# Altium project vme_can_pcb_v4.PrjPcb (part 2 of 2)

## Sheet vme_can_fpga_bridge.SchDoc: =GlobalProjectName
size 594 x 420 mm; SheetNumber: 6; SheetTotal: 8; PageSetup: Record=PageOptions|CenterHorizontal=True|CenterVertical=True|PrintScale=1.00|XCorrection=1.00|YCorrection=1.00|PrintKind=1|BorderSize=5000000|LeftOffset=0|BottomOffset=0|Orientation=2|PaperLength=1000|PaperWidth=1000|Scale=100|PaperSource=15|PrintQuality=1200|MediaType=1|DitherType=10|PaperKind=A3|PrintScaleMode=1; Weight: -; ScaleFactor: -
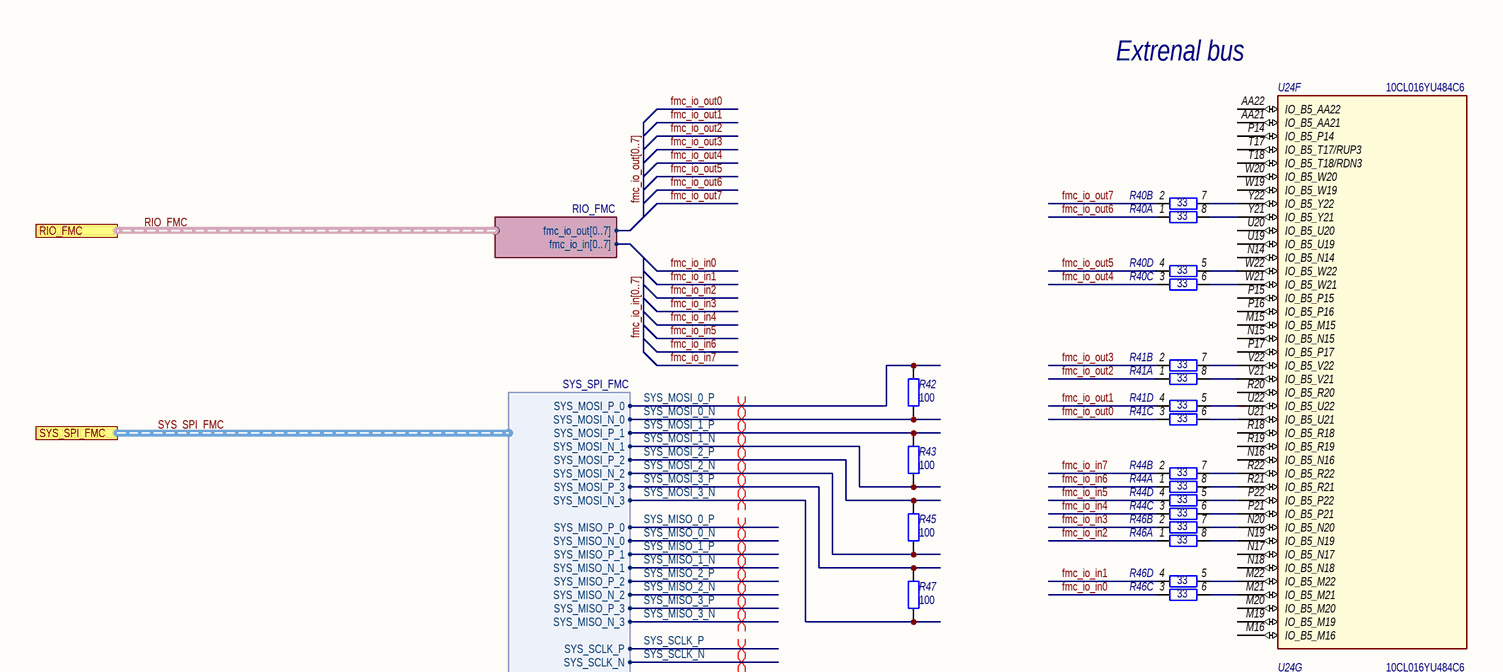
[diagram p5: vme_can_fpga_bridge.SchDoc, top left]
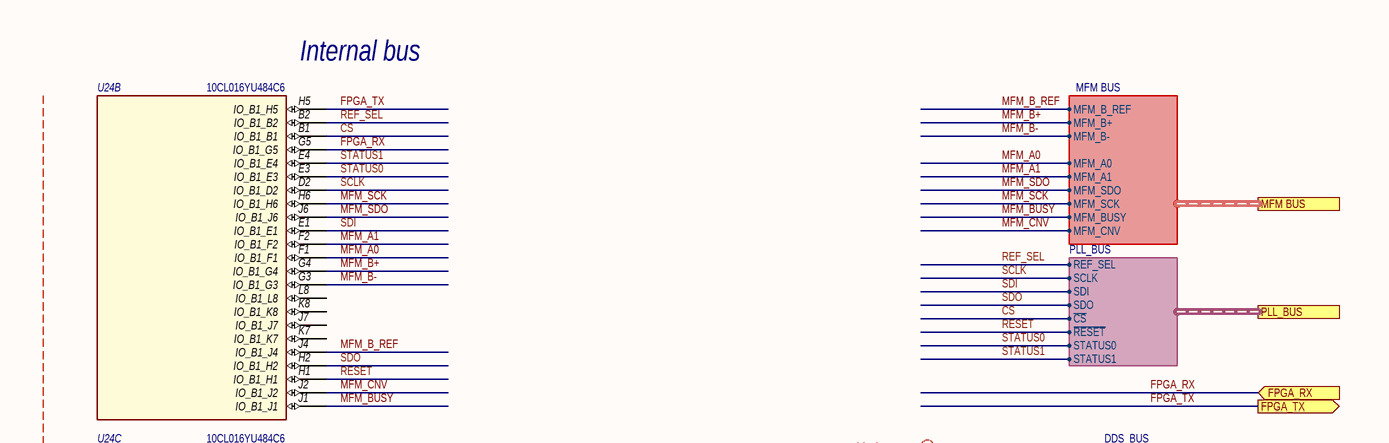
[diagram p6: vme_can_fpga_bridge.SchDoc, top right]
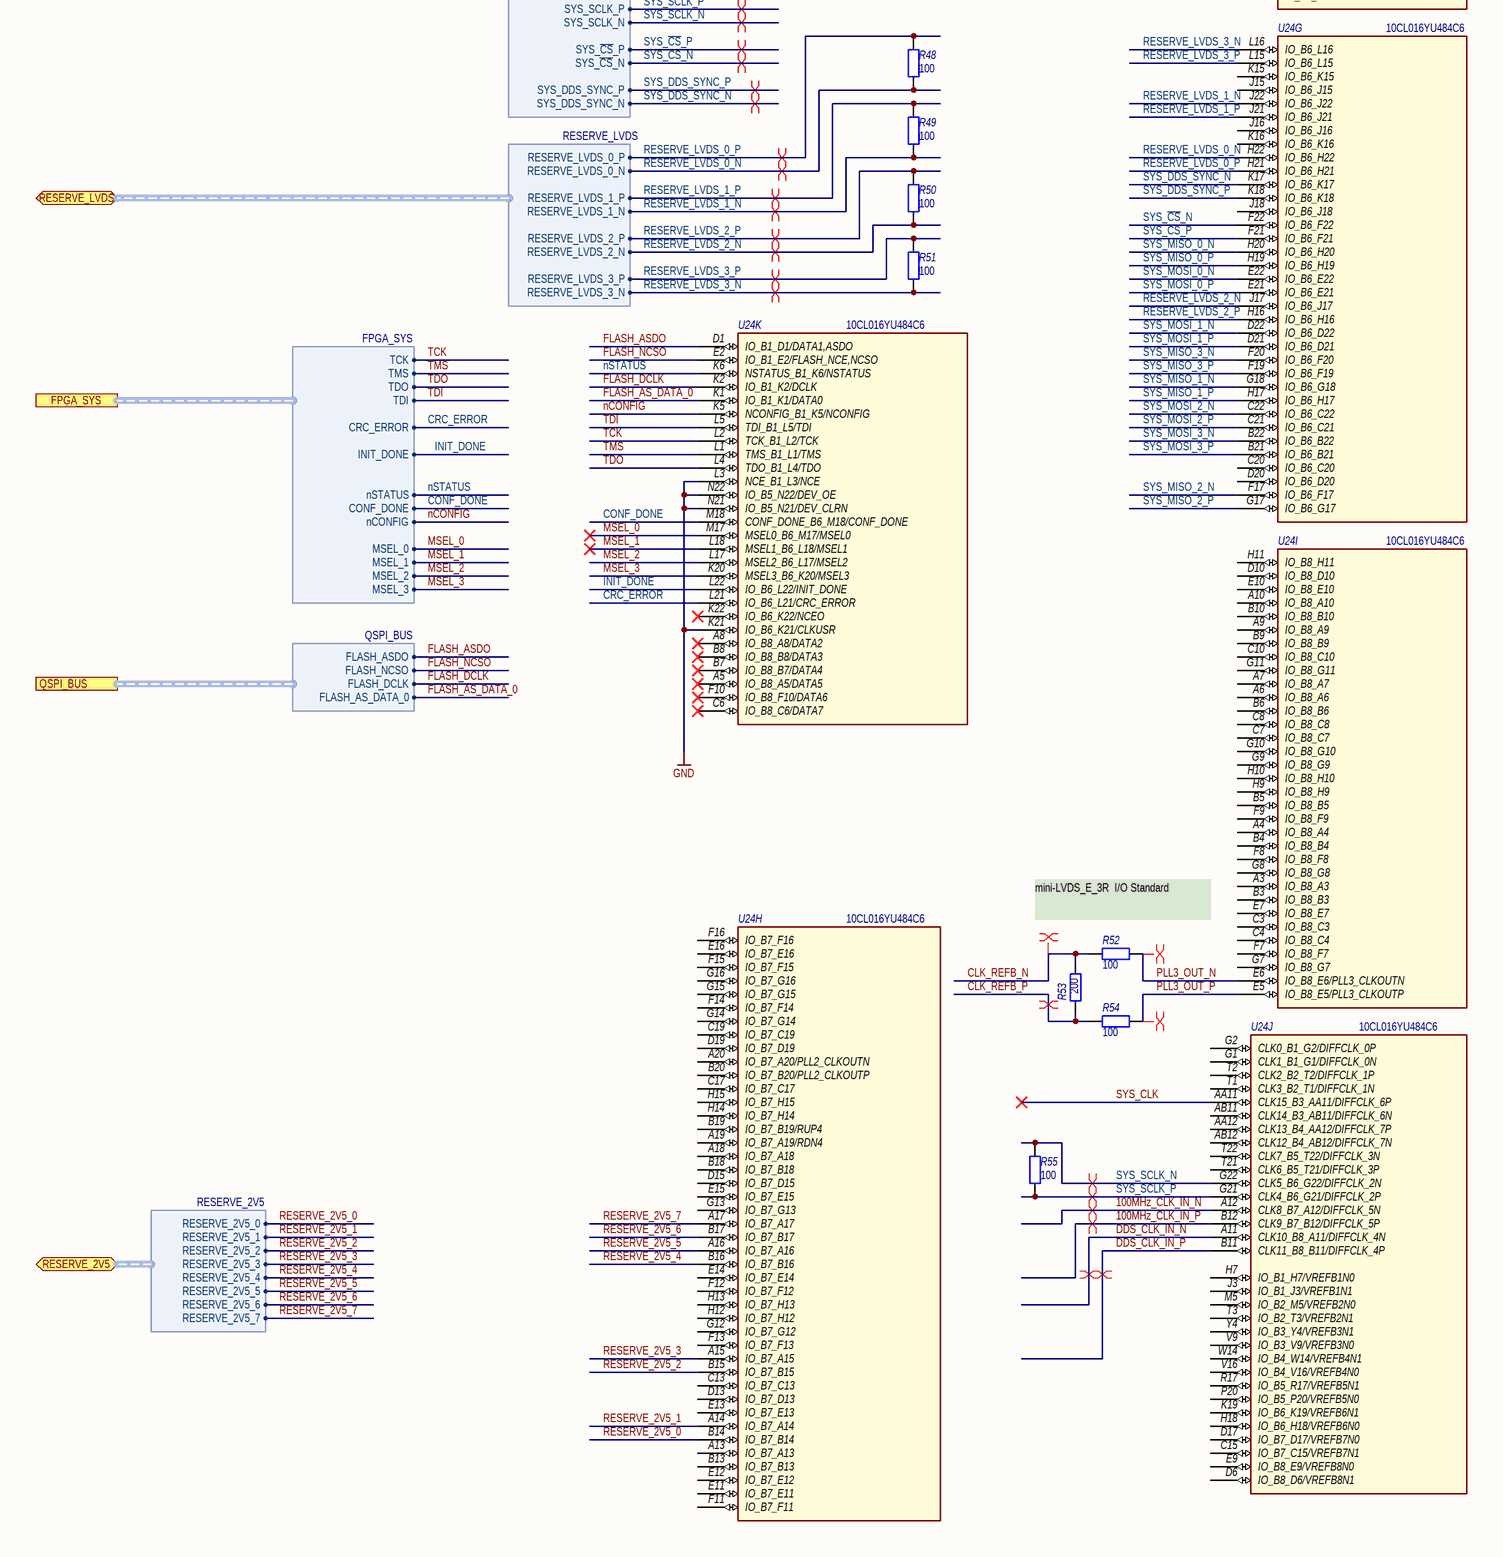
[diagram p7: vme_can_fpga_bridge.SchDoc, bottom left]
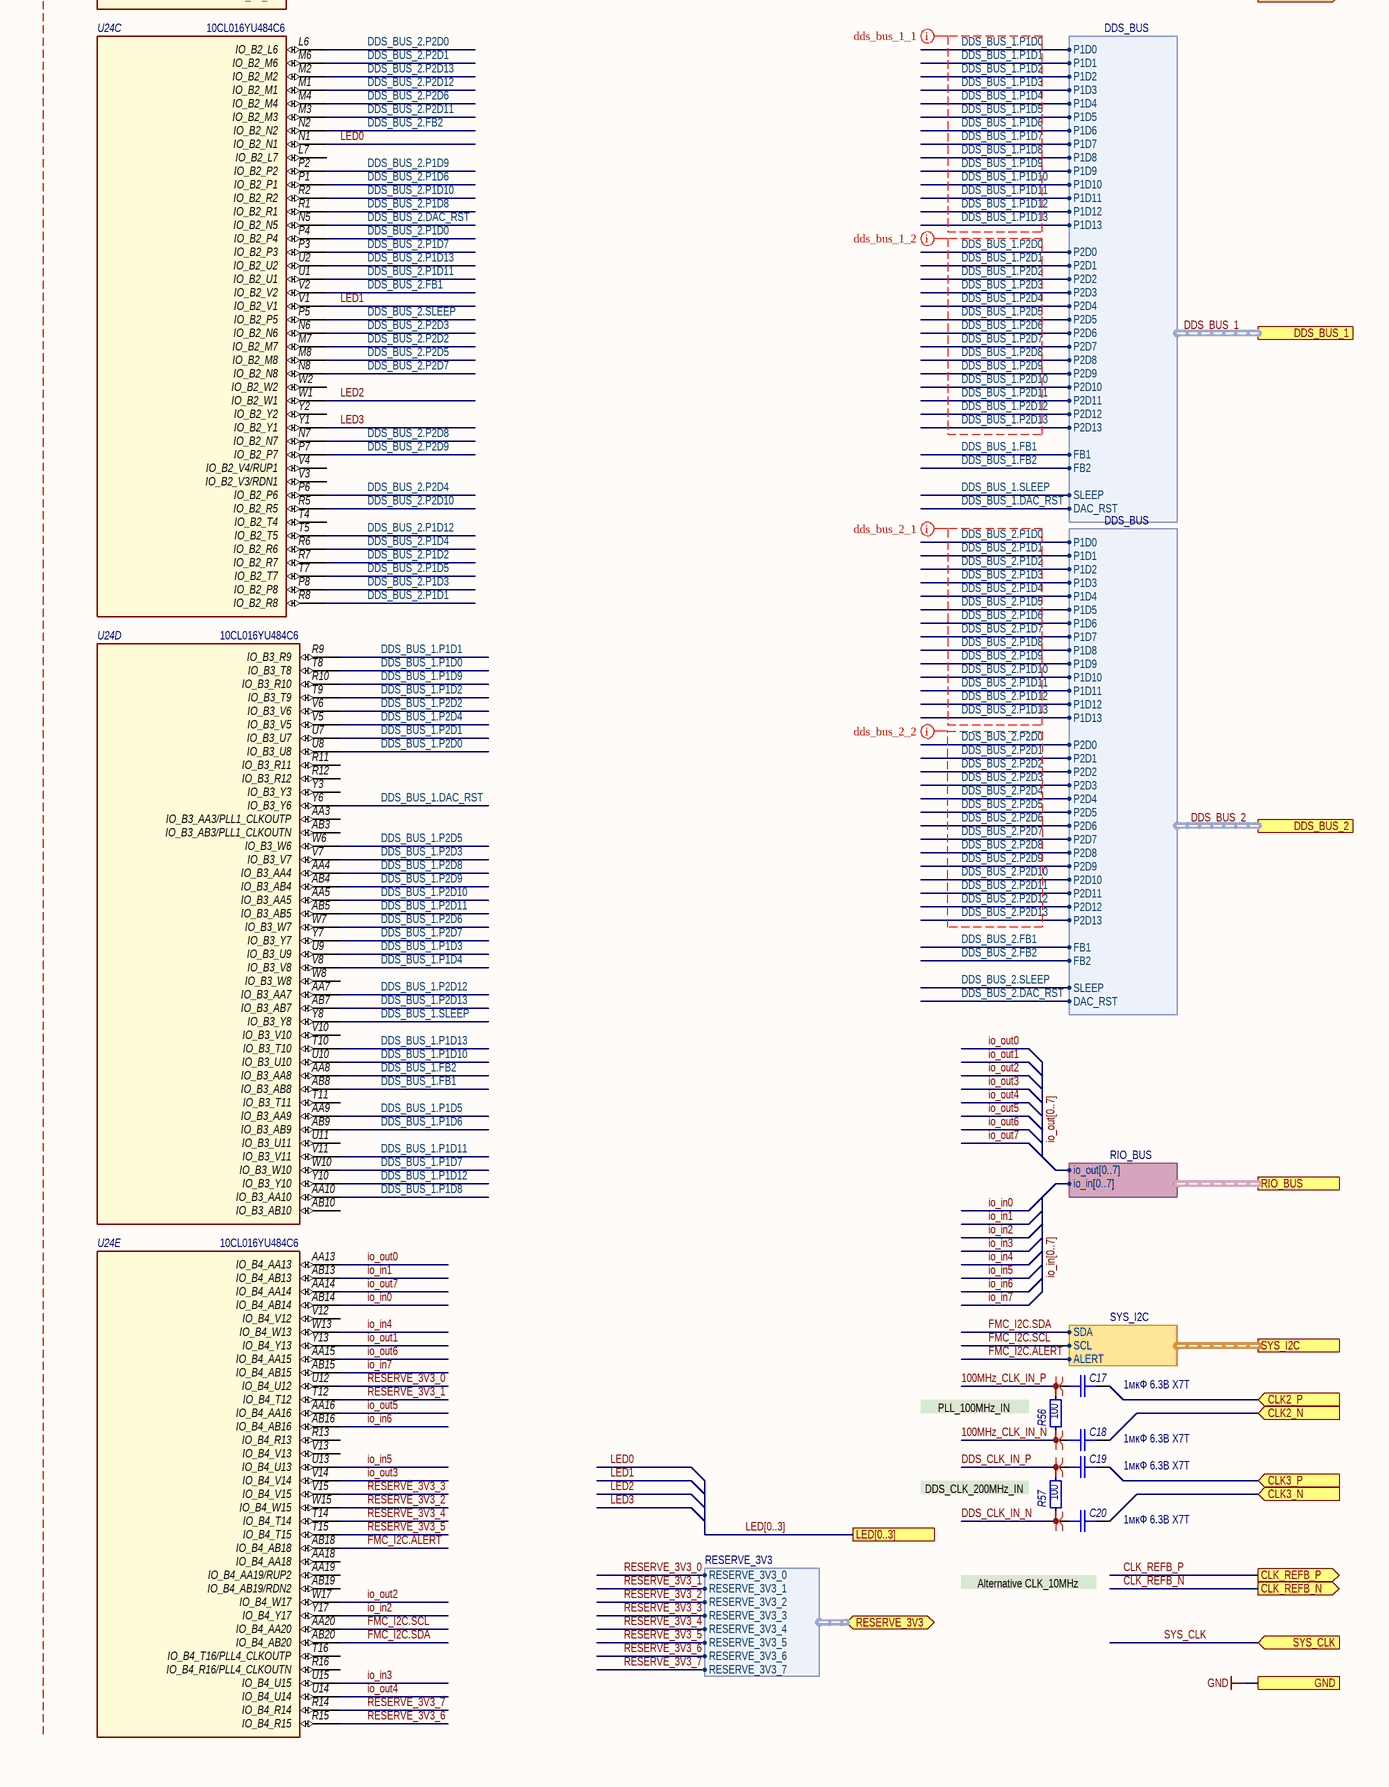
[diagram p8: vme_can_fpga_bridge.SchDoc, bottom right]

### Parts
C17  1мкФ 6.3В X7T  [SMD_C0603]
C18  1мкФ 6.3В X7T  [SMD_C0603]
C19  1мкФ 6.3В X7T  [SMD_C0603]
C20  1мкФ 6.3В X7T  [SMD_C0603]
R40  value 33  [TC124]  (hidden comment: 4 Chip Resistor Array)  (parts A,B,C,D of 4)
R41  value 33  [TC124]  (hidden comment: 4 Chip Resistor Array)  (parts A,B,C,D of 4)
R42  100  [SMD_0603]
R43  100  [SMD_0603]
R44  value 33  [TC124]  (hidden comment: 4 Chip Resistor Array)  (parts A,B,C,D of 4)
R45  100  [SMD_0603]
R46  value 33  [TC124]  (hidden comment: 4 Chip Resistor Array)  (parts A,B,C,D of 4)
R47  100  [SMD_0603]
R48  100  [SMD_0603]
R49  100  [SMD_0603]
R50  100  [SMD_0603]
R51  100  [SMD_0603]
R52  100  [SMD_0603]
R53  200  [SMD_0603]
R54  100  [SMD_0603]
R55  100  [SMD_0603]
R56  100  [SMD_0603]
R57  100  [SMD_0603]
U24  Наименование: 10CL016YU484С6  [UBGA-484]  (hidden comment: 10CL016YU484)  (parts B,C,D,E,F,G,H,I,J,K of 13)

### Ports
CLK2_N (in), CLK2_P (in), CLK3_N (in), CLK3_P (in), CLK_REFB_N (out), CLK_REFB_P (out), DDS_BUS_1 (harness DDS_BUS), DDS_BUS_2 (harness DDS_BUS), FPGA_RX (in), FPGA_SYS (harness FPGA_SYS), FPGA_TX (out), GND, LED[0..3], MFM BUS (harness MFM BUS), PLL_BUS (harness PLL_BUS), QSPI_BUS (harness QSPI_BUS), RESERVE_2V5 (bidir, harness RESERVE_2V5), RESERVE_3V3 (bidir, harness RESERVE_3V3), RESERVE_LVDS (bidir, harness RESERVE_LVDS), RIO_BUS (harness RIO_BUS), RIO_FMC (harness RIO_FMC), SYS_CLK (in), SYS_I2C (harness SYS_I2C), SYS_SPI_FMC (harness SYS_SPI_FMC)

### Harnesses
MFM BUS: MFM_A0, MFM_A1, MFM_SDO, MFM_SCK, MFM_BUSY, MFM_CNV, MFM_B_REF, MFM_B+, MFM_B-
RIO_FMC: fmc_io_out[0..7], fmc_io_in[0..7]
FPGA_SYS: TCK, TMS, TDO, TDI, CRC_ERROR, nSTATUS, CONF_DONE, nCONFIG, MSEL_0, MSEL_1, MSEL_2, MSEL_3, INIT_DONE
SYS_SPI_FMC: SYS_MOSI_P_0, SYS_SCLK_P, SYS_~{CS}_P, SYS_MOSI_P_1, SYS_MOSI_P_2, SYS_MOSI_P_3, SYS_MOSI_N_0, SYS_MOSI_N_1, SYS_MOSI_N_2, SYS_MOSI_N_3, SYS_MISO_P_0, SYS_MISO_P_1, SYS_MISO_P_2, SYS_MISO_P_3, SYS_MISO_N_0, SYS_MISO_N_1, SYS_MISO_N_2, SYS_MISO_N_3, SYS_SCLK_N, SYS_DDS_SYNC_P, SYS_~{CS}_N, SYS_DDS_SYNC_N
SYS_I2C: SDA, SCL, ALERT
PLL_BUS: REF_SEL, SCLK, SDI, SDO, ~{CS}, ~{RESET}, STATUS0, STATUS1
RIO_BUS: io_out[0..7], io_in[0..7]
RESERVE_LVDS: RESERVE_LVDS_0_P, RESERVE_LVDS_0_N, RESERVE_LVDS_1_P, RESERVE_LVDS_1_N, RESERVE_LVDS_2_P, RESERVE_LVDS_2_N, RESERVE_LVDS_3_P, RESERVE_LVDS_3_N
RESERVE_3V3: RESERVE_3V3_0, RESERVE_3V3_1, RESERVE_3V3_2, RESERVE_3V3_3, RESERVE_3V3_4, RESERVE_3V3_5, RESERVE_3V3_6, RESERVE_3V3_7
QSPI_BUS: FLASH_ASDO, FLASH_NCSO, FLASH_DCLK, FLASH_AS_DATA_0
RESERVE_2V5: RESERVE_2V5_0, RESERVE_2V5_1, RESERVE_2V5_2, RESERVE_2V5_3, RESERVE_2V5_4, RESERVE_2V5_5, RESERVE_2V5_6, RESERVE_2V5_7
DDS_BUS: P1D0, P1D1, P1D2, P1D3, P1D4, P1D5, P1D6, P1D7, P1D8, P1D9, P1D10, P1D11, P1D12, P1D13, P2D0, P2D1, P2D2, P2D3, P2D4, P2D5, P2D6, P2D7, P2D8, P2D9, P2D10, P2D11, P2D12, P2D13, FB1, SLEEP, DAC_RST, FB2

### Nets
GND: U24.K21(IO_B6_K21/CLKUSR) U24.L3(NCE_B1_L3/NCE) U24.N21(IO_B5_N21/DEV_CLRN) U24.N22(IO_B5_N22/DEV_OE) ; port GND
100MHz_CLK_IN_N: C18.1 R56.1 U24.A12(CLK8_B7_A12/DIFFCLK_5N)
100MHz_CLK_IN_P: C17.2 R56.2 U24.B12(CLK9_B7_B12/DIFFCLK_5P)
~{CS}: U24.B1(IO_B1_B1) ; port PLL_BUS.~{CS}
CLK_REFB_N: R52.2 R53.2 ; port CLK_REFB_N
CLK_REFB_P: R53.1 R54.2 ; port CLK_REFB_P
CONF_DONE: U24.M18(CONF_DONE_B6_M18/CONF_DONE) ; port FPGA_SYS.CONF_DONE
CRC_ERROR: U24.L21(IO_B6_L21/CRC_ERROR) ; port FPGA_SYS.CRC_ERROR
DDS_BUS_1.DAC_RST: U24.Y6(IO_B3_Y6) ; port DDS_BUS_1.DAC_RST
DDS_BUS_1.FB1: U24.AB8(IO_B3_AB8) ; port DDS_BUS_1.FB1
DDS_BUS_1.FB2: U24.AA8(IO_B3_AA8) ; port DDS_BUS_1.FB2
DDS_BUS_1.P1D0: U24.T8(IO_B3_T8) ; port DDS_BUS_1.P1D0
DDS_BUS_1.P1D1: U24.R9(IO_B3_R9) ; port DDS_BUS_1.P1D1
DDS_BUS_1.P1D2: U24.T9(IO_B3_T9) ; port DDS_BUS_1.P1D2
DDS_BUS_1.P1D3: U24.U9(IO_B3_U9) ; port DDS_BUS_1.P1D3
DDS_BUS_1.P1D4: U24.V8(IO_B3_V8) ; port DDS_BUS_1.P1D4
DDS_BUS_1.P1D5: U24.AA9(IO_B3_AA9) ; port DDS_BUS_1.P1D5
DDS_BUS_1.P1D6: U24.AB9(IO_B3_AB9) ; port DDS_BUS_1.P1D6
DDS_BUS_1.P1D7: U24.W10(IO_B3_W10) ; port DDS_BUS_1.P1D7
DDS_BUS_1.P1D8: U24.AA10(IO_B3_AA10) ; port DDS_BUS_1.P1D8
DDS_BUS_1.P1D9: U24.R10(IO_B3_R10) ; port DDS_BUS_1.P1D9
DDS_BUS_1.P1D10: U24.U10(IO_B3_U10) ; port DDS_BUS_1.P1D10
DDS_BUS_1.P1D11: U24.V11(IO_B3_V11) ; port DDS_BUS_1.P1D11
DDS_BUS_1.P1D12: U24.Y10(IO_B3_Y10) ; port DDS_BUS_1.P1D12
DDS_BUS_1.P1D13: U24.T10(IO_B3_T10) ; port DDS_BUS_1.P1D13
DDS_BUS_1.P2D0: U24.U8(IO_B3_U8) ; port DDS_BUS_1.P2D0
DDS_BUS_1.P2D1: U24.U7(IO_B3_U7) ; port DDS_BUS_1.P2D1
DDS_BUS_1.P2D2: U24.V6(IO_B3_V6) ; port DDS_BUS_1.P2D2
DDS_BUS_1.P2D3: U24.V7(IO_B3_V7) ; port DDS_BUS_1.P2D3
DDS_BUS_1.P2D4: U24.V5(IO_B3_V5) ; port DDS_BUS_1.P2D4
DDS_BUS_1.P2D5: U24.W6(IO_B3_W6) ; port DDS_BUS_1.P2D5
DDS_BUS_1.P2D6: U24.W7(IO_B3_W7) ; port DDS_BUS_1.P2D6
DDS_BUS_1.P2D7: U24.Y7(IO_B3_Y7) ; port DDS_BUS_1.P2D7
DDS_BUS_1.P2D8: U24.AA4(IO_B3_AA4) ; port DDS_BUS_1.P2D8
DDS_BUS_1.P2D9: U24.AB4(IO_B3_AB4) ; port DDS_BUS_1.P2D9
DDS_BUS_1.P2D10: U24.AA5(IO_B3_AA5) ; port DDS_BUS_1.P2D10
DDS_BUS_1.P2D11: U24.AB5(IO_B3_AB5) ; port DDS_BUS_1.P2D11
DDS_BUS_1.P2D12: U24.AA7(IO_B3_AA7) ; port DDS_BUS_1.P2D12
DDS_BUS_1.P2D13: U24.AB7(IO_B3_AB7) ; port DDS_BUS_1.P2D13
DDS_BUS_1.SLEEP: U24.Y8(IO_B3_Y8) ; port DDS_BUS_1.SLEEP
DDS_BUS_2.DAC_RST: U24.N5(IO_B2_N5) ; port DDS_BUS_2.DAC_RST
DDS_BUS_2.FB1: U24.V2(IO_B2_V2) ; port DDS_BUS_2.FB1
DDS_BUS_2.FB2: U24.N2(IO_B2_N2) ; port DDS_BUS_2.FB2
DDS_BUS_2.P1D0: U24.P4(IO_B2_P4) ; port DDS_BUS_2.P1D0
DDS_BUS_2.P1D1: U24.R8(IO_B2_R8) ; port DDS_BUS_2.P1D1
DDS_BUS_2.P1D2: U24.R7(IO_B2_R7) ; port DDS_BUS_2.P1D2
DDS_BUS_2.P1D3: U24.P8(IO_B2_P8) ; port DDS_BUS_2.P1D3
DDS_BUS_2.P1D4: U24.R6(IO_B2_R6) ; port DDS_BUS_2.P1D4
DDS_BUS_2.P1D5: U24.T7(IO_B2_T7) ; port DDS_BUS_2.P1D5
DDS_BUS_2.P1D6: U24.P1(IO_B2_P1) ; port DDS_BUS_2.P1D6
DDS_BUS_2.P1D7: U24.P3(IO_B2_P3) ; port DDS_BUS_2.P1D7
DDS_BUS_2.P1D8: U24.R1(IO_B2_R1) ; port DDS_BUS_2.P1D8
DDS_BUS_2.P1D9: U24.P2(IO_B2_P2) ; port DDS_BUS_2.P1D9
DDS_BUS_2.P1D10: U24.R2(IO_B2_R2) ; port DDS_BUS_2.P1D10
DDS_BUS_2.P1D11: U24.U1(IO_B2_U1) ; port DDS_BUS_2.P1D11
DDS_BUS_2.P1D12: U24.T5(IO_B2_T5) ; port DDS_BUS_2.P1D12
DDS_BUS_2.P1D13: U24.U2(IO_B2_U2) ; port DDS_BUS_2.P1D13
DDS_BUS_2.P2D0: U24.L6(IO_B2_L6) ; port DDS_BUS_2.P2D0
DDS_BUS_2.P2D1: U24.M6(IO_B2_M6) ; port DDS_BUS_2.P2D1
DDS_BUS_2.P2D2: U24.M7(IO_B2_M7) ; port DDS_BUS_2.P2D2
DDS_BUS_2.P2D3: U24.N6(IO_B2_N6) ; port DDS_BUS_2.P2D3
DDS_BUS_2.P2D4: U24.P6(IO_B2_P6) ; port DDS_BUS_2.P2D4
DDS_BUS_2.P2D5: U24.M8(IO_B2_M8) ; port DDS_BUS_2.P2D5
DDS_BUS_2.P2D6: U24.M4(IO_B2_M4) ; port DDS_BUS_2.P2D6
DDS_BUS_2.P2D7: U24.N8(IO_B2_N8) ; port DDS_BUS_2.P2D7
DDS_BUS_2.P2D8: U24.N7(IO_B2_N7) ; port DDS_BUS_2.P2D8
DDS_BUS_2.P2D9: U24.P7(IO_B2_P7) ; port DDS_BUS_2.P2D9
DDS_BUS_2.P2D10: U24.R5(IO_B2_R5) ; port DDS_BUS_2.P2D10
DDS_BUS_2.P2D11: U24.M3(IO_B2_M3) ; port DDS_BUS_2.P2D11
DDS_BUS_2.P2D12: U24.M1(IO_B2_M1) ; port DDS_BUS_2.P2D12
DDS_BUS_2.P2D13: U24.M2(IO_B2_M2) ; port DDS_BUS_2.P2D13
DDS_BUS_2.SLEEP: U24.P5(IO_B2_P5) ; port DDS_BUS_2.SLEEP
DDS_CLK_IN_N: C20.1 R57.1 U24.A11(CLK10_B8_A11/DIFFCLK_4N)
DDS_CLK_IN_P: C19.2 R57.2 U24.B11(CLK11_B8_B11/DIFFCLK_4P)
FLASH_AS_DATA_0: U24.K1(IO_B1_K1/DATA0) ; port QSPI_BUS.FLASH_AS_DATA_0
FLASH_ASDO: U24.D1(IO_B1_D1/DATA1,ASDO) ; port QSPI_BUS.FLASH_ASDO
FLASH_DCLK: U24.K2(IO_B1_K2/DCLK) ; port QSPI_BUS.FLASH_DCLK
FLASH_NCSO: U24.E2(IO_B1_E2/FLASH_NCE,NCSO) ; port QSPI_BUS.FLASH_NCSO
FMC_I2C.ALERT: U24.AB18(IO_B4_AB18) ; port SYS_I2C.ALERT
FMC_I2C.SCL: U24.AA20(IO_B4_AA20) ; port SYS_I2C.SCL
FMC_I2C.SDA: U24.AB20(IO_B4_AB20) ; port SYS_I2C.SDA
fmc_io_in0: R46.3
fmc_io_in1: R46.4
fmc_io_in2: R46.1
fmc_io_in3: R46.2
fmc_io_in4: R44.3
fmc_io_in5: R44.4
fmc_io_in6: R44.1
fmc_io_in7: R44.2
fmc_io_out0: R41.3
fmc_io_out1: R41.4
fmc_io_out2: R41.1
fmc_io_out3: R41.2
fmc_io_out4: R40.3
fmc_io_out5: R40.4
fmc_io_out6: R40.1
fmc_io_out7: R40.2
FPGA_RX: U24.G5(IO_B1_G5) ; port FPGA_RX
FPGA_TX: U24.H5(IO_B1_H5) ; port FPGA_TX
INIT_DONE: U24.L22(IO_B6_L22/INIT_DONE) ; port FPGA_SYS.INIT_DONE
io_in0: U24.AB14(IO_B4_AB14)
io_in1: U24.AB13(IO_B4_AB13)
io_in2: U24.Y17(IO_B4_Y17)
io_in3: U24.U15(IO_B4_U15)
io_in4: U24.W13(IO_B4_W13)
io_in5: U24.U13(IO_B4_U13)
io_in6: U24.AB16(IO_B4_AB16)
io_in7: U24.AB15(IO_B4_AB15)
io_out0: U24.AA13(IO_B4_AA13)
io_out1: U24.Y13(IO_B4_Y13)
io_out2: U24.W17(IO_B4_W17)
io_out3: U24.V14(IO_B4_V14)
io_out4: U24.U14(IO_B4_U14)
io_out5: U24.AA16(IO_B4_AA16)
io_out6: U24.AA15(IO_B4_AA15)
io_out7: U24.AA14(IO_B4_AA14)
LED0: U24.N1(IO_B2_N1)
LED1: U24.V1(IO_B2_V1)
LED2: U24.W1(IO_B2_W1)
LED3: U24.Y1(IO_B2_Y1)
MFM_A0: U24.F1(IO_B1_F1) ; port MFM BUS.MFM_A0
MFM_A1: U24.F2(IO_B1_F2) ; port MFM BUS.MFM_A1
MFM_B+: U24.G4(IO_B1_G4) ; port MFM BUS.MFM_B+
MFM_B-: U24.G3(IO_B1_G3) ; port MFM BUS.MFM_B-
MFM_B_REF: U24.J4(IO_B1_J4) ; port MFM BUS.MFM_B_REF
MFM_BUSY: U24.J1(IO_B1_J1) ; port MFM BUS.MFM_BUSY
MFM_CNV: U24.J2(IO_B1_J2) ; port MFM BUS.MFM_CNV
MFM_SCK: U24.H6(IO_B1_H6) ; port MFM BUS.MFM_SCK
MFM_SDO: U24.J6(IO_B1_J6) ; port MFM BUS.MFM_SDO
MSEL_0: U24.M17(MSEL0_B6_M17/MSEL0) ; port FPGA_SYS.MSEL_0
MSEL_1: U24.L18(MSEL1_B6_L18/MSEL1) ; port FPGA_SYS.MSEL_1
MSEL_2: U24.L17(MSEL2_B6_L17/MSEL2) ; port FPGA_SYS.MSEL_2
MSEL_3: U24.K20(MSEL3_B6_K20/MSEL3) ; port FPGA_SYS.MSEL_3
nCONFIG: U24.K5(NCONFIG_B1_K5/NCONFIG) ; port FPGA_SYS.nCONFIG
nSTATUS: U24.K6(NSTATUS_B1_K6/NSTATUS) ; port FPGA_SYS.nSTATUS
PLL3_OUT_N: R52.1 U24.E6(IO_B8_E6/PLL3_CLKOUTN)
PLL3_OUT_P: R54.1 U24.E5(IO_B8_E5/PLL3_CLKOUTP)
~{RESET}: U24.H1(IO_B1_H1) ; port PLL_BUS.~{RESET}
REF_SEL: U24.B2(IO_B1_B2) ; port PLL_BUS.REF_SEL
RESERVE_2V5_0: U24.B14(IO_B7_B14) ; port RESERVE_2V5.RESERVE_2V5_0
RESERVE_2V5_1: U24.A14(IO_B7_A14) ; port RESERVE_2V5.RESERVE_2V5_1
RESERVE_2V5_2: U24.B15(IO_B7_B15) ; port RESERVE_2V5.RESERVE_2V5_2
RESERVE_2V5_3: U24.A15(IO_B7_A15) ; port RESERVE_2V5.RESERVE_2V5_3
RESERVE_2V5_4: U24.B16(IO_B7_B16) ; port RESERVE_2V5.RESERVE_2V5_4
RESERVE_2V5_5: U24.A16(IO_B7_A16) ; port RESERVE_2V5.RESERVE_2V5_5
RESERVE_2V5_6: U24.B17(IO_B7_B17) ; port RESERVE_2V5.RESERVE_2V5_6
RESERVE_2V5_7: U24.A17(IO_B7_A17) ; port RESERVE_2V5.RESERVE_2V5_7
RESERVE_3V3_0: U24.U12(IO_B4_U12) ; port RESERVE_3V3.RESERVE_3V3_0
RESERVE_3V3_1: U24.T12(IO_B4_T12) ; port RESERVE_3V3.RESERVE_3V3_1
RESERVE_3V3_2: U24.W15(IO_B4_W15) ; port RESERVE_3V3.RESERVE_3V3_2
RESERVE_3V3_3: U24.V15(IO_B4_V15) ; port RESERVE_3V3.RESERVE_3V3_3
RESERVE_3V3_4: U24.T14(IO_B4_T14) ; port RESERVE_3V3.RESERVE_3V3_4
RESERVE_3V3_5: U24.T15(IO_B4_T15) ; port RESERVE_3V3.RESERVE_3V3_5
RESERVE_3V3_6: U24.R15(IO_B4_R15) ; port RESERVE_3V3.RESERVE_3V3_6
RESERVE_3V3_7: U24.R14(IO_B4_R14) ; port RESERVE_3V3.RESERVE_3V3_7
RESERVE_LVDS_0_N: R48.2 U24.H22(IO_B6_H22) ; port RESERVE_LVDS.RESERVE_LVDS_0_N
RESERVE_LVDS_0_P: R48.1 U24.H21(IO_B6_H21) ; port RESERVE_LVDS.RESERVE_LVDS_0_P
RESERVE_LVDS_1_N: R49.2 U24.J22(IO_B6_J22) ; port RESERVE_LVDS.RESERVE_LVDS_1_N
RESERVE_LVDS_1_P: R49.1 U24.J21(IO_B6_J21) ; port RESERVE_LVDS.RESERVE_LVDS_1_P
RESERVE_LVDS_2_N: R50.2 U24.J17(IO_B6_J17) ; port RESERVE_LVDS.RESERVE_LVDS_2_N
RESERVE_LVDS_2_P: R50.1 U24.H16(IO_B6_H16) ; port RESERVE_LVDS.RESERVE_LVDS_2_P
RESERVE_LVDS_3_N: R51.2 U24.L16(IO_B6_L16) ; port RESERVE_LVDS.RESERVE_LVDS_3_N
RESERVE_LVDS_3_P: R51.1 U24.L15(IO_B6_L15) ; port RESERVE_LVDS.RESERVE_LVDS_3_P
SCLK: U24.D2(IO_B1_D2) ; port PLL_BUS.SCLK
SDI: U24.E1(IO_B1_E1) ; port PLL_BUS.SDI
SDO: U24.H2(IO_B1_H2) ; port PLL_BUS.SDO
STATUS0: U24.E3(IO_B1_E3) ; port PLL_BUS.STATUS0
STATUS1: U24.E4(IO_B1_E4) ; port PLL_BUS.STATUS1
SYS_~{CS}_N: U24.F22(IO_B6_F22) ; port SYS_SPI_FMC.SYS_~{CS}_N
SYS_~{CS}_P: U24.F21(IO_B6_F21) ; port SYS_SPI_FMC.SYS_~{CS}_P
SYS_CLK: U24.AA11(CLK15_B3_AA11/DIFFCLK_6P) ; port SYS_CLK
SYS_DDS_SYNC_N: U24.K17(IO_B6_K17) ; port SYS_SPI_FMC.SYS_DDS_SYNC_N
SYS_DDS_SYNC_P: U24.K18(IO_B6_K18) ; port SYS_SPI_FMC.SYS_DDS_SYNC_P
SYS_MISO_0_N: U24.H20(IO_B6_H20) ; port SYS_SPI_FMC.SYS_MISO_N_0
SYS_MISO_0_P: U24.H19(IO_B6_H19) ; port SYS_SPI_FMC.SYS_MISO_P_0
SYS_MISO_1_N: U24.G18(IO_B6_G18) ; port SYS_SPI_FMC.SYS_MISO_N_1
SYS_MISO_1_P: U24.H17(IO_B6_H17) ; port SYS_SPI_FMC.SYS_MISO_P_1
SYS_MISO_2_N: U24.F17(IO_B6_F17) ; port SYS_SPI_FMC.SYS_MISO_N_2
SYS_MISO_2_P: U24.G17(IO_B6_G17) ; port SYS_SPI_FMC.SYS_MISO_P_2
SYS_MISO_3_N: U24.F20(IO_B6_F20) ; port SYS_SPI_FMC.SYS_MISO_N_3
SYS_MISO_3_P: U24.F19(IO_B6_F19) ; port SYS_SPI_FMC.SYS_MISO_P_3
SYS_MOSI_0_N: R42.2 U24.E22(IO_B6_E22) ; port SYS_SPI_FMC.SYS_MOSI_N_0
SYS_MOSI_0_P: R42.1 U24.E21(IO_B6_E21) ; port SYS_SPI_FMC.SYS_MOSI_P_0
SYS_MOSI_1_N: R43.2 U24.D22(IO_B6_D22) ; port SYS_SPI_FMC.SYS_MOSI_N_1
SYS_MOSI_1_P: R43.1 U24.D21(IO_B6_D21) ; port SYS_SPI_FMC.SYS_MOSI_P_1
SYS_MOSI_2_N: R45.2 U24.C22(IO_B6_C22) ; port SYS_SPI_FMC.SYS_MOSI_N_2
SYS_MOSI_2_P: R45.1 U24.C21(IO_B6_C21) ; port SYS_SPI_FMC.SYS_MOSI_P_2
SYS_MOSI_3_N: R47.2 U24.B22(IO_B6_B22) ; port SYS_SPI_FMC.SYS_MOSI_N_3
SYS_MOSI_3_P: R47.1 U24.B21(IO_B6_B21) ; port SYS_SPI_FMC.SYS_MOSI_P_3
SYS_SCLK_N: R55.1 U24.G22(CLK5_B6_G22/DIFFCLK_2N) ; port SYS_SPI_FMC.SYS_SCLK_N
SYS_SCLK_P: R55.2 U24.G21(CLK4_B6_G21/DIFFCLK_2P) ; port SYS_SPI_FMC.SYS_SCLK_P
TCK: U24.L2(TCK_B1_L2/TCK) ; port FPGA_SYS.TCK
TDI: U24.L5(TDI_B1_L5/TDI) ; port FPGA_SYS.TDI
TDO: U24.L4(TDO_B1_L4/TDO) ; port FPGA_SYS.TDO
TMS: U24.L1(TMS_B1_L1/TMS) ; port FPGA_SYS.TMS
NetC17_1: C17.1 ; port CLK2_P
NetC18_2: C18.2 ; port CLK2_N
NetC19_1: C19.1 ; port CLK3_P
NetC20_2: C20.2 ; port CLK3_N
NetR40_5: R40.5 U24.W22(IO_B5_W22)
NetR40_6: R40.6 U24.W21(IO_B5_W21)
NetR40_7: R40.7 U24.Y22(IO_B5_Y22)
NetR40_8: R40.8 U24.Y21(IO_B5_Y21)
NetR41_5: R41.5 U24.U22(IO_B5_U22)
NetR41_6: R41.6 U24.U21(IO_B5_U21)
NetR41_7: R41.7 U24.V22(IO_B5_V22)
NetR41_8: R41.8 U24.V21(IO_B5_V21)
NetR44_5: R44.5 U24.P22(IO_B5_P22)
NetR44_6: R44.6 U24.P21(IO_B5_P21)
NetR44_7: R44.7 U24.R22(IO_B5_R22)
NetR44_8: R44.8 U24.R21(IO_B5_R21)
NetR46_5: R46.5 U24.M22(IO_B5_M22)
NetR46_6: R46.6 U24.M21(IO_B5_M21)
NetR46_7: R46.7 U24.N20(IO_B5_N20)
NetR46_8: R46.8 U24.N19(IO_B5_N19)

Not connected (* = marked no-connect by the designer): U24 A3(IO_B8_A3) A4(IO_B8_A4) A5(IO_B8_A5/DATA5)* A6(IO_B8_A6) A7(IO_B8_A7) A8(IO_B8_A8/DATA2)* A9(IO_B8_A9) A10(IO_B8_A10) A13(IO_B7_A13) A18(IO_B7_A18) A19(IO_B7_A19/RDN4) A20(IO_B7_A20/PLL2_CLKOUTN) AA3(IO_B3_AA3/PLL1_CLKOUTP) AA12(CLK13_B4_AA12/DIFFCLK_7P) AA18(IO_B4_AA18) AA19(IO_B4_AA19/RUP2) AA21(IO_B5_AA21) AA22(IO_B5_AA22) AB3(IO_B3_AB3/PLL1_CLKOUTN) AB10(IO_B3_AB10) AB11(CLK14_B3_AB11/DIFFCLK_6N) AB12(CLK12_B4_AB12/DIFFCLK_7N) AB19(IO_B4_AB19/RDN2) B3(IO_B8_B3) B4(IO_B8_B4) B5(IO_B8_B5) B6(IO_B8_B6) B7(IO_B8_B7/DATA4)* B8(IO_B8_B8/DATA3)* B9(IO_B8_B9) B10(IO_B8_B10) B13(IO_B7_B13) B18(IO_B7_B18) B19(IO_B7_B19/RUP4) B20(IO_B7_B20/PLL2_CLKOUTP) C3(IO_B8_C3) C4(IO_B8_C4) C6(IO_B8_C6/DATA7)* C7(IO_B8_C7) C8(IO_B8_C8) C10(IO_B8_C10) C13(IO_B7_C13) C15(IO_B7_C15/VREFB7N1) C17(IO_B7_C17) C19(IO_B7_C19) C20(IO_B6_C20) D6(IO_B8_D6/VREFB8N1) D10(IO_B8_D10) D13(IO_B7_D13) D15(IO_B7_D15) D17(IO_B7_D17/VREFB7N0) D19(IO_B7_D19) D20(IO_B6_D20) E7(IO_B8_E7) E9(IO_B8_E9/VREFB8N0) E10(IO_B8_E10) E11(IO_B7_E11) E12(IO_B7_E12) E13(IO_B7_E13) E14(IO_B7_E14) E15(IO_B7_E15) E16(IO_B7_E16) F7(IO_B8_F7) F8(IO_B8_F8) F9(IO_B8_F9) F10(IO_B8_F10/DATA6)* F11(IO_B7_F11) F12(IO_B7_F12) F13(IO_B7_F13) F14(IO_B7_F14) F15(IO_B7_F15) F16(IO_B7_F16) G1(CLK1_B1_G1/DIFFCLK_0N) G2(CLK0_B1_G2/DIFFCLK_0P) G7(IO_B8_G7) G8(IO_B8_G8) G9(IO_B8_G9) G10(IO_B8_G10) G11(IO_B8_G11) G12(IO_B7_G12) G13(IO_B7_G13) G14(IO_B7_G14) G15(IO_B7_G15) G16(IO_B7_G16) H7(IO_B1_H7/VREFB1N0) H9(IO_B8_H9) H10(IO_B8_H10) H11(IO_B8_H11) H12(IO_B7_H12) H13(IO_B7_H13) H14(IO_B7_H14) H15(IO_B7_H15) H18(IO_B6_H18/VREFB6N0) J3(IO_B1_J3/VREFB1N1) J7(IO_B1_J7) J15(IO_B6_J15) J16(IO_B6_J16) J18(IO_B6_J18) K7(IO_B1_K7) K8(IO_B1_K8) K15(IO_B6_K15) K16(IO_B6_K16) K19(IO_B6_K19/VREFB6N1) K22(IO_B6_K22/NCEO)* L7(IO_B2_L7) L8(IO_B1_L8) M5(IO_B2_M5/VREFB2N0) M15(IO_B5_M15) M16(IO_B5_M16) M19(IO_B5_M19) M20(IO_B5_M20) N14(IO_B5_N14) N15(IO_B5_N15) N16(IO_B5_N16) N17(IO_B5_N17) N18(IO_B5_N18) P14(IO_B5_P14) P15(IO_B5_P15) P16(IO_B5_P16) P17(IO_B5_P17) P20(IO_B5_P20/VREFB5N0) R11(IO_B3_R11) R12(IO_B3_R12) R13(IO_B4_R13) R16(IO_B4_R16/PLL4_CLKOUTN) R17(IO_B5_R17/VREFB5N1) R18(IO_B5_R18) R19(IO_B5_R19) R20(IO_B5_R20) T1(CLK3_B2_T1/DIFFCLK_1N) T2(CLK2_B2_T2/DIFFCLK_1P) T3(IO_B2_T3/VREFB2N1) T4(IO_B2_T4) T11(IO_B3_T11) T16(IO_B4_T16/PLL4_CLKOUTP) T17(IO_B5_T17/RUP3) T18(IO_B5_T18/RDN3) T21(CLK6_B5_T21/DIFFCLK_3P) T22(CLK7_B5_T22/DIFFCLK_3N) U11(IO_B3_U11) U19(IO_B5_U19) U20(IO_B5_U20) V3(IO_B2_V3/RDN1) V4(IO_B2_V4/RUP1) V9(IO_B3_V9/VREFB3N0) V10(IO_B3_V10) V12(IO_B4_V12) V13(IO_B4_V13) V16(IO_B4_V16/VREFB4N0) W2(IO_B2_W2) W8(IO_B3_W8) W14(IO_B4_W14/VREFB4N1) W19(IO_B5_W19) W20(IO_B5_W20) Y2(IO_B2_Y2) Y3(IO_B3_Y3) Y4(IO_B3_Y4/VREFB3N1)

### Buses and harness runs
bus fmc_io_in[0..7]
bus fmc_io_out[0..7]
bus io_in[0..7]
bus io_out[0..7]
bus LED[0..3] = port LED[0..3]
harness DDS_BUS_1 = port DDS_BUS_1
harness DDS_BUS_2 = port DDS_BUS_2
harness RIO_FMC = port RIO_FMC
harness SYS_SPI_FMC = port SYS_SPI_FMC

### Layout directives
differential pair: 100MHz_CLK_IN_N, 100MHz_CLK_IN_P, CLK_REFB_N, CLK_REFB_P, DDS_CLK_IN_N, DDS_CLK_IN_P, PLL3_OUT_N, PLL3_OUT_P, RESERVE_LVDS_0_N, RESERVE_LVDS_0_P, RESERVE_LVDS_1_N, RESERVE_LVDS_1_P, RESERVE_LVDS_2_N, RESERVE_LVDS_2_P, RESERVE_LVDS_3_N, RESERVE_LVDS_3_P, SYS_DDS_SYNC_N, SYS_DDS_SYNC_P, SYS_MISO_0_N, SYS_MISO_0_P, SYS_MISO_1_N, SYS_MISO_1_P, SYS_MISO_2_N, SYS_MISO_2_P, SYS_MISO_3_N, SYS_MISO_3_P, SYS_MOSI_0_N, SYS_MOSI_0_P, SYS_MOSI_1_N, SYS_MOSI_1_P, SYS_MOSI_2_N, SYS_MOSI_2_P, SYS_MOSI_3_N, SYS_MOSI_3_P, SYS_SCLK_N, SYS_SCLK_P, SYS_~{CS}_N, SYS_~{CS}_P
net class dds_bus_1_1: DDS_BUS_1.P1D0, DDS_BUS_1.P1D1, DDS_BUS_1.P1D2, DDS_BUS_1.P1D3, DDS_BUS_1.P1D4, DDS_BUS_1.P1D5, DDS_BUS_1.P1D6, DDS_BUS_1.P1D7, DDS_BUS_1.P1D8, DDS_BUS_1.P1D9, DDS_BUS_1.P1D10, DDS_BUS_1.P1D11, DDS_BUS_1.P1D12, DDS_BUS_1.P1D13
net class dds_bus_1_2: DDS_BUS_1.P2D0, DDS_BUS_1.P2D1, DDS_BUS_1.P2D2, DDS_BUS_1.P2D3, DDS_BUS_1.P2D4, DDS_BUS_1.P2D5, DDS_BUS_1.P2D6, DDS_BUS_1.P2D7, DDS_BUS_1.P2D8, DDS_BUS_1.P2D9, DDS_BUS_1.P2D10, DDS_BUS_1.P2D11, DDS_BUS_1.P2D12, DDS_BUS_1.P2D13
net class dds_bus_2_1: DDS_BUS_2.P1D0, DDS_BUS_2.P1D1, DDS_BUS_2.P1D2, DDS_BUS_2.P1D3, DDS_BUS_2.P1D4, DDS_BUS_2.P1D5, DDS_BUS_2.P1D6, DDS_BUS_2.P1D7, DDS_BUS_2.P1D8, DDS_BUS_2.P1D9, DDS_BUS_2.P1D10, DDS_BUS_2.P1D11, DDS_BUS_2.P1D12, DDS_BUS_2.P1D13
net class dds_bus_2_2: DDS_BUS_2.P2D0, DDS_BUS_2.P2D1, DDS_BUS_2.P2D2, DDS_BUS_2.P2D3, DDS_BUS_2.P2D4, DDS_BUS_2.P2D5, DDS_BUS_2.P2D6, DDS_BUS_2.P2D7, DDS_BUS_2.P2D8, DDS_BUS_2.P2D9, DDS_BUS_2.P2D10, DDS_BUS_2.P2D11, DDS_BUS_2.P2D12, DDS_BUS_2.P2D13

### Notes on the sheet
- (near U24) Extrenal bus
- (near U24) Internal bus
- mini-LVDS_E_3R  I/O Standard
- PLL_100MHz_IN
- DDS_CLK_200MHz_IN
- Alternative CLK_10MHz
- Перв. примен.
- Справ. №
- Подп. и дата
- Инв. № дубл.
- Взам. инв. №
- Инв. № подл.
- Изм.
- Лист
- № докум.
- Подп.
- Дата
- Форма 2а ГОСТ 2.104-2006
- Копировал
- Формат А2

### Library data of the parts
C17-C20 = Capacitor: Назначение: SMD-конденсатор; Наименование: GRM033D70J105ME01; Потребление, Вт: 0; Value: 1мкФ 6.3В X7T
R40 R41 R44 R46 = Resistor-4: Потребление, Вт: 0.0; Наименование: TC124-FR-0733RL; Назначение: 4 Chip Resistor Array; Описание: TC124-FR-0733RL
R42 R43 R45 R47-R57 = Resistor: as R8 on sheet vme_can_can
  R42 R43 R45 R47-R52 R54-R57: Value: 100
  R53: Value: 200
U24 = 10CL016_U484: Intel® Cyclone® 10 LP FPGA; Потребление, Вт: 0.5; Назначение: Intel® Cyclone® 10 LP FPGA; ComponentLink1Description: DataSheet; ComponentLink1URL: https://www.intel.com/content/dam/www/programmable/us/en/pdfs/literature/hb/cyclone-10/c10lp-51002.pdf; ComponentLink2Description: PinConnectionGuidlines; ComponentLink2URL: https://www.intel.com/content/dam/www/programmable/us/en/pdfs/literature/dp/cyclone-10/pcg-01021.pdf; Supplier 1: Mouser; Supplier Part Number 1: 989-10CL016YU484C6G

## Sheet vme_can_fpga_pwr.SchDoc: =GlobalProjectName
size 209 x 297 mm; SheetNumber: 8; SheetTotal: 8; PageSetup: Record=PageOptions|CenterHorizontal=True|CenterVertical=True|PrintScale=1.00|XCorrection=1.00|YCorrection=1.00|PrintKind=1|BorderSize=5000000|LeftOffset=0|BottomOffset=0|Orientation=2|PaperLength=1000|PaperWidth=1000|Scale=100|PaperSource=15|PrintQuality=1200|MediaType=1|DitherType=10|PaperKind=A3|PrintScaleMode=1; Weight: -; ScaleFactor: -
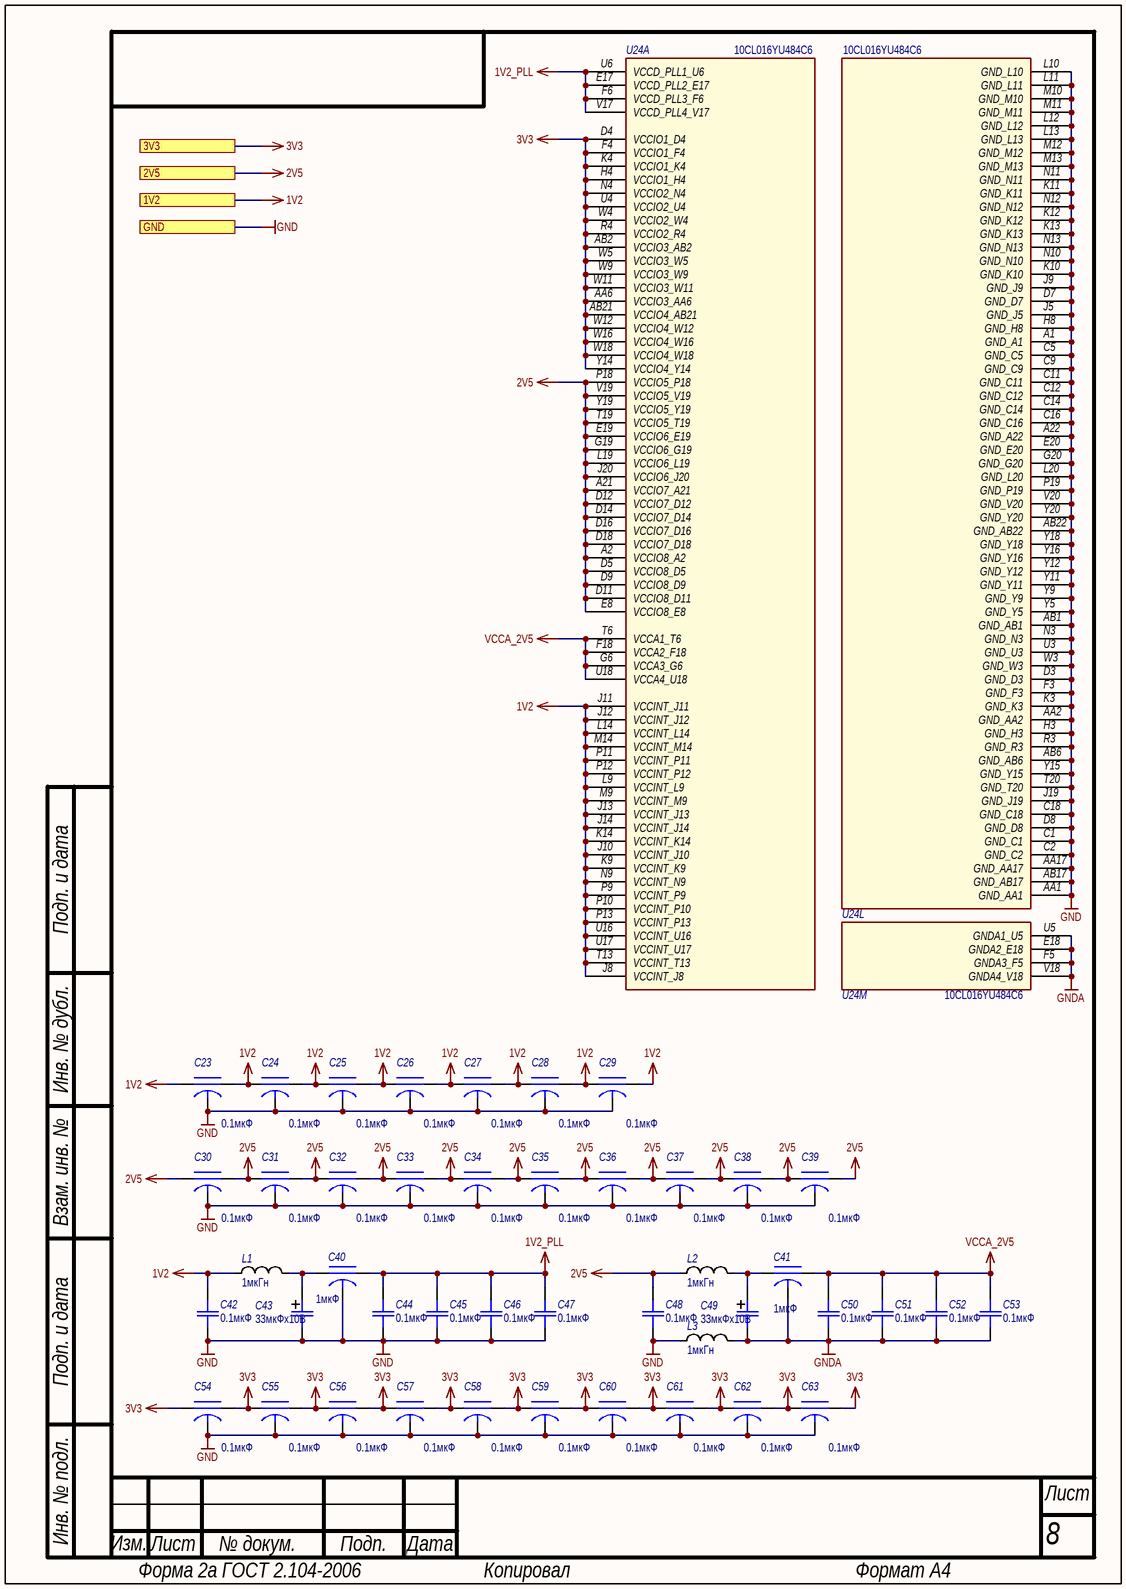
[diagram p9: vme_can_fpga_pwr.SchDoc]

### Parts
C23  value 0.1мкФ  [3pol_SMD0402]  (hidden comment: NFM15PC104D0J3)
C24  value 0.1мкФ  [3pol_SMD0402]  (hidden comment: NFM15PC104D0J3)
C25  value 0.1мкФ  [3pol_SMD0402]  (hidden comment: NFM15PC104D0J3)
C26  value 0.1мкФ  [3pol_SMD0402]  (hidden comment: NFM15PC104D0J3)
C27  value 0.1мкФ  [3pol_SMD0402]  (hidden comment: NFM15PC104D0J3)
C28  value 0.1мкФ  [3pol_SMD0402]  (hidden comment: NFM15PC104D0J3)
C29  value 0.1мкФ  [3pol_SMD0402]  (hidden comment: NFM15PC104D0J3)
C30  value 0.1мкФ  [3pol_SMD0402]  (hidden comment: NFM15PC104D0J3)
C31  value 0.1мкФ  [3pol_SMD0402]  (hidden comment: NFM15PC104D0J3)
C32  value 0.1мкФ  [3pol_SMD0402]  (hidden comment: NFM15PC104D0J3)
C33  value 0.1мкФ  [3pol_SMD0402]  (hidden comment: NFM15PC104D0J3)
C34  value 0.1мкФ  [3pol_SMD0402]  (hidden comment: NFM15PC104D0J3)
C35  value 0.1мкФ  [3pol_SMD0402]  (hidden comment: NFM15PC104D0J3)
C36  value 0.1мкФ  [3pol_SMD0402]  (hidden comment: NFM15PC104D0J3)
C37  value 0.1мкФ  [3pol_SMD0402]  (hidden comment: NFM15PC104D0J3)
C38  value 0.1мкФ  [3pol_SMD0402]  (hidden comment: NFM15PC104D0J3)
C39  value 0.1мкФ  [3pol_SMD0402]  (hidden comment: NFM15PC104D0J3)
C40  value 1мкФ  [3pol_SMD0402]  (hidden comment: NFM15PC105D0J3)
C41  value 1мкФ  [3pol_SMD0402]  (hidden comment: NFM15PC105D0J3)
C42  0.1мкФ  [SMD_C0402]
C43  33мкФх10В  [SMD_size_B]
C44  0.1мкФ  [SMD_C0402]
C45  0.1мкФ  [SMD_C0402]
C46  0.1мкФ  [SMD_C0402]
C47  0.1мкФ  [SMD_C0402]
C48  0.1мкФ  [SMD_C0402]
C49  33мкФх10В  [SMD_size_B]
C50  0.1мкФ  [SMD_C0402]
C51  0.1мкФ  [SMD_C0402]
C52  0.1мкФ  [SMD_C0402]
C53  0.1мкФ  [SMD_C0402]
C54  value 0.1мкФ  [3pol_SMD0402]  (hidden comment: NFM15PC104D0J3)
C55  value 0.1мкФ  [3pol_SMD0402]  (hidden comment: NFM15PC104D0J3)
C56  value 0.1мкФ  [3pol_SMD0402]  (hidden comment: NFM15PC104D0J3)
C57  value 0.1мкФ  [3pol_SMD0402]  (hidden comment: NFM15PC104D0J3)
C58  value 0.1мкФ  [3pol_SMD0402]  (hidden comment: NFM15PC104D0J3)
C59  value 0.1мкФ  [3pol_SMD0402]  (hidden comment: NFM15PC104D0J3)
C60  value 0.1мкФ  [3pol_SMD0402]  (hidden comment: NFM15PC104D0J3)
C61  value 0.1мкФ  [3pol_SMD0402]  (hidden comment: NFM15PC104D0J3)
C62  value 0.1мкФ  [3pol_SMD0402]  (hidden comment: NFM15PC104D0J3)
C63  value 0.1мкФ  [3pol_SMD0402]  (hidden comment: NFM15PC104D0J3)
L1  1мкГн  [SMD_0805]
L2  1мкГн  [SMD_0805]
L3  1мкГн  [SMD_0805]
U24  Наименование: 10CL016YU484С6  [UBGA-484]  (hidden comment: 10CL016YU484)  (parts A,L,M of 13)

### Ports
1V2, 2V5, 3V3, GND

### Nets
1V2: C23.1(Input) C23.3(Output) C24.1(Input) C24.3(Output) C25.1(Input) C25.3(Output) C26.1(Input) C26.3(Output) C27.1(Input) C27.3(Output) C28.1(Input) C28.3(Output) C29.1(Input) C29.3(Output) C42.2 L1.2 U24.J8(VCCINT_J8) U24.J10(VCCINT_J10) U24.J11(VCCINT_J11) U24.J12(VCCINT_J12) U24.J13(VCCINT_J13) U24.J14(VCCINT_J14) U24.K9(VCCINT_K9) U24.K14(VCCINT_K14) U24.L9(VCCINT_L9) U24.L14(VCCINT_L14) U24.M9(VCCINT_M9) U24.M14(VCCINT_M14) U24.N9(VCCINT_N9) U24.P9(VCCINT_P9) U24.P10(VCCINT_P10) U24.P11(VCCINT_P11) U24.P12(VCCINT_P12) U24.P13(VCCINT_P13) U24.T13(VCCINT_T13) U24.U16(VCCINT_U16) U24.U17(VCCINT_U17) ; port 1V2
1V2_PLL: C40.1(Input) C44.2 C45.2 C46.2 C47.2 U24.E17(VCCD_PLL2_E17) U24.F6(VCCD_PLL3_F6) U24.U6(VCCD_PLL1_U6) U24.V17(VCCD_PLL4_V17)
2V5: C30.1(Input) C30.3(Output) C31.1(Input) C31.3(Output) C32.1(Input) C32.3(Output) C33.1(Input) C33.3(Output) C34.1(Input) C34.3(Output) C35.1(Input) C35.3(Output) C36.1(Input) C36.3(Output) C37.1(Input) C37.3(Output) C38.1(Input) C38.3(Output) C39.1(Input) C39.3(Output) C48.2 L2.2 U24.A2(VCCIO8_A2) U24.A21(VCCIO7_A21) U24.D5(VCCIO8_D5) U24.D9(VCCIO8_D9) U24.D11(VCCIO8_D11) U24.D12(VCCIO7_D12) U24.D14(VCCIO7_D14) U24.D16(VCCIO7_D16) U24.D18(VCCIO7_D18) U24.E8(VCCIO8_E8) U24.E19(VCCIO6_E19) U24.G19(VCCIO6_G19) U24.J20(VCCIO6_J20) U24.L19(VCCIO6_L19) U24.P18(VCCIO5_P18) U24.T19(VCCIO5_T19) U24.V19(VCCIO5_V19) U24.Y19(VCCIO5_Y19) ; port 2V5
3V3: C54.1(Input) C54.3(Output) C55.1(Input) C55.3(Output) C56.1(Input) C56.3(Output) C57.1(Input) C57.3(Output) C58.1(Input) C58.3(Output) C59.1(Input) C59.3(Output) C60.1(Input) C60.3(Output) C61.1(Input) C61.3(Output) C62.1(Input) C62.3(Output) C63.1(Input) C63.3(Output) U24.AA6(VCCIO3_AA6) U24.AB2(VCCIO3_AB2) U24.AB21(VCCIO4_AB21) U24.D4(VCCIO1_D4) U24.F4(VCCIO1_F4) U24.H4(VCCIO1_H4) U24.K4(VCCIO1_K4) U24.N4(VCCIO2_N4) U24.R4(VCCIO2_R4) U24.U4(VCCIO2_U4) U24.W4(VCCIO2_W4) U24.W5(VCCIO3_W5) U24.W9(VCCIO3_W9) U24.W11(VCCIO3_W11) U24.W12(VCCIO4_W12) U24.W16(VCCIO4_W16) U24.W18(VCCIO4_W18) U24.Y14(VCCIO4_Y14) ; port 3V3
GND: C23.2(GND) C24.2(GND) C25.2(GND) C26.2(GND) C27.2(GND) C28.2(GND) C29.2(GND) C30.2(GND) C31.2(GND) C32.2(GND) C33.2(GND) C34.2(GND) C35.2(GND) C36.2(GND) C37.2(GND) C38.2(GND) C39.2(GND) C40.2(GND) C42.1 C43.2 C44.1 C45.1 C46.1 C47.1 C48.1 C54.2(GND) C55.2(GND) C56.2(GND) C57.2(GND) C58.2(GND) C59.2(GND) C60.2(GND) C61.2(GND) C62.2(GND) C63.2(GND) L3.2 U24.A1(GND_A1) U24.A22(GND_A22) U24.AA1(GND_AA1) U24.AA2(GND_AA2) U24.AA17(GND_AA17) U24.AB1(GND_AB1) U24.AB6(GND_AB6) U24.AB17(GND_AB17) U24.AB22(GND_AB22) U24.C1(GND_C1) U24.C2(GND_C2) U24.C5(GND_C5) U24.C9(GND_C9) U24.C11(GND_C11) U24.C12(GND_C12) U24.C14(GND_C14) U24.C16(GND_C16) U24.C18(GND_C18) U24.D3(GND_D3) U24.D7(GND_D7) U24.D8(GND_D8) U24.E20(GND_E20) U24.F3(GND_F3) U24.G20(GND_G20) U24.H3(GND_H3) U24.H8(GND_H8) U24.J5(GND_J5) U24.J9(GND_J9) U24.J19(GND_J19) U24.K3(GND_K3) U24.K10(GND_K10) U24.K11(GND_K11) U24.K12(GND_K12) U24.K13(GND_K13) U24.L10(GND_L10) U24.L11(GND_L11) U24.L12(GND_L12) U24.L13(GND_L13) U24.L20(GND_L20) U24.M10(GND_M10) U24.M11(GND_M11) U24.M12(GND_M12) U24.M13(GND_M13) U24.N3(GND_N3) U24.N10(GND_N10) U24.N11(GND_N11) U24.N12(GND_N12) U24.N13(GND_N13) U24.P19(GND_P19) U24.R3(GND_R3) U24.T20(GND_T20) U24.U3(GND_U3) U24.V20(GND_V20) U24.W3(GND_W3) U24.Y5(GND_Y5) U24.Y9(GND_Y9) U24.Y11(GND_Y11) U24.Y12(GND_Y12) U24.Y15(GND_Y15) U24.Y16(GND_Y16) U24.Y18(GND_Y18) U24.Y20(GND_Y20) ; port GND
GNDA: C41.2(GND) C49.2 C50.1 C51.1 C52.1 C53.1 L3.1 U24.E18(GNDA2_E18) U24.F5(GNDA3_F5) U24.U5(GNDA1_U5) U24.V18(GNDA4_V18)
VCCA_2V5: C41.1(Input) C50.2 C51.2 C52.2 C53.2 U24.F18(VCCA2_F18) U24.G6(VCCA3_G6) U24.T6(VCCA1_T6) U24.U18(VCCA4_U18)
NetC40_3: C40.3(Output) C43.1 L1.1
NetC41_3: C41.3(Output) C49.1 L2.1

### Notes on the sheet
- Подп. и дата
- Инв. № дубл.
- Взам. инв. №
- Инв. № подл.
- Изм.
- Лист
- № докум.
- Подп.
- Дата
- Форма 2а ГОСТ 2.104-2006
- Копировал
- Формат А4

### Library data of the parts
C23-C41 C54-C63 = Capacitop_3Pol: Large Current 3 Terminals Low ESL Chip Multilayer Ceramic Capacitors for General Purpose, 0402, 2200pF, 20%, 10V; Потребление, Вт: 0.0; Назначение: 3 Terminals Low ESL Chip Multilayer Ceramic Capacitors (EMIFIL) for General Purpose; ComponentLink1Description: DataSheet; ComponentLink1URL: https://search.murata.co.jp/Ceramy/image/img/A01X/G101/ENG/NFM15CC222D1A3-01.pdf; ComponentLink2Description: UsingMethod; ComponentLink2URL: https://article.murata.com/en-global/article/methods-of-using-low-esl-capacitors
  C23-C39 C54-C63: Наименование: NFM15PC104D0J3
  C40 C41: Наименование: NFM15PC105D0J3
C42 C44-C48 C50-C53 = Capacitor: Назначение: SMD-конденсатор; Наименование: Конденсатор; Потребление, Вт: 0; Value: 0.1мкФ
C43 C49 = Capacitor_pol: Polarized capacitor; Назначение: Поляризованный SMD-конденсатор; Наименование: Поляризованный конденсатор; Потребление, Вт: 0; Value: 33мкФх10В
L1-L3 = Inductor: Наименование: Индуктивность; Назначение: SMD-индуктивность; Потребление, Вт: 0,010; Value: 1мкГн
U24 = 10CL016_U484: Intel® Cyclone® 10 LP FPGA; Потребление, Вт: 0.5; Назначение: Intel® Cyclone® 10 LP FPGA; ComponentLink1Description: DataSheet; ComponentLink1URL: https://www.intel.com/content/dam/www/programmable/us/en/pdfs/literature/hb/cyclone-10/c10lp-51002.pdf; ComponentLink2Description: PinConnectionGuidlines; ComponentLink2URL: https://www.intel.com/content/dam/www/programmable/us/en/pdfs/literature/dp/cyclone-10/pcg-01021.pdf; Supplier 1: Mouser; Supplier Part Number 1: 989-10CL016YU484C6G

## Sheet vme_can_fpga_conf.SchDoc: =GlobalProjectName
size 209 x 297 mm; SheetNumber: 7; SheetTotal: 8; PageSetup: Record=PageOptions|CenterHorizontal=True|CenterVertical=True|PrintScale=1.00|XCorrection=1.00|YCorrection=1.00|PrintKind=1|BorderSize=5000000|LeftOffset=0|BottomOffset=0|Orientation=2|PaperLength=1000|PaperWidth=1000|Scale=100|PaperSource=15|PrintQuality=1200|MediaType=1|DitherType=10|PaperKind=A3|PrintScaleMode=1; Weight: -; ScaleFactor: -
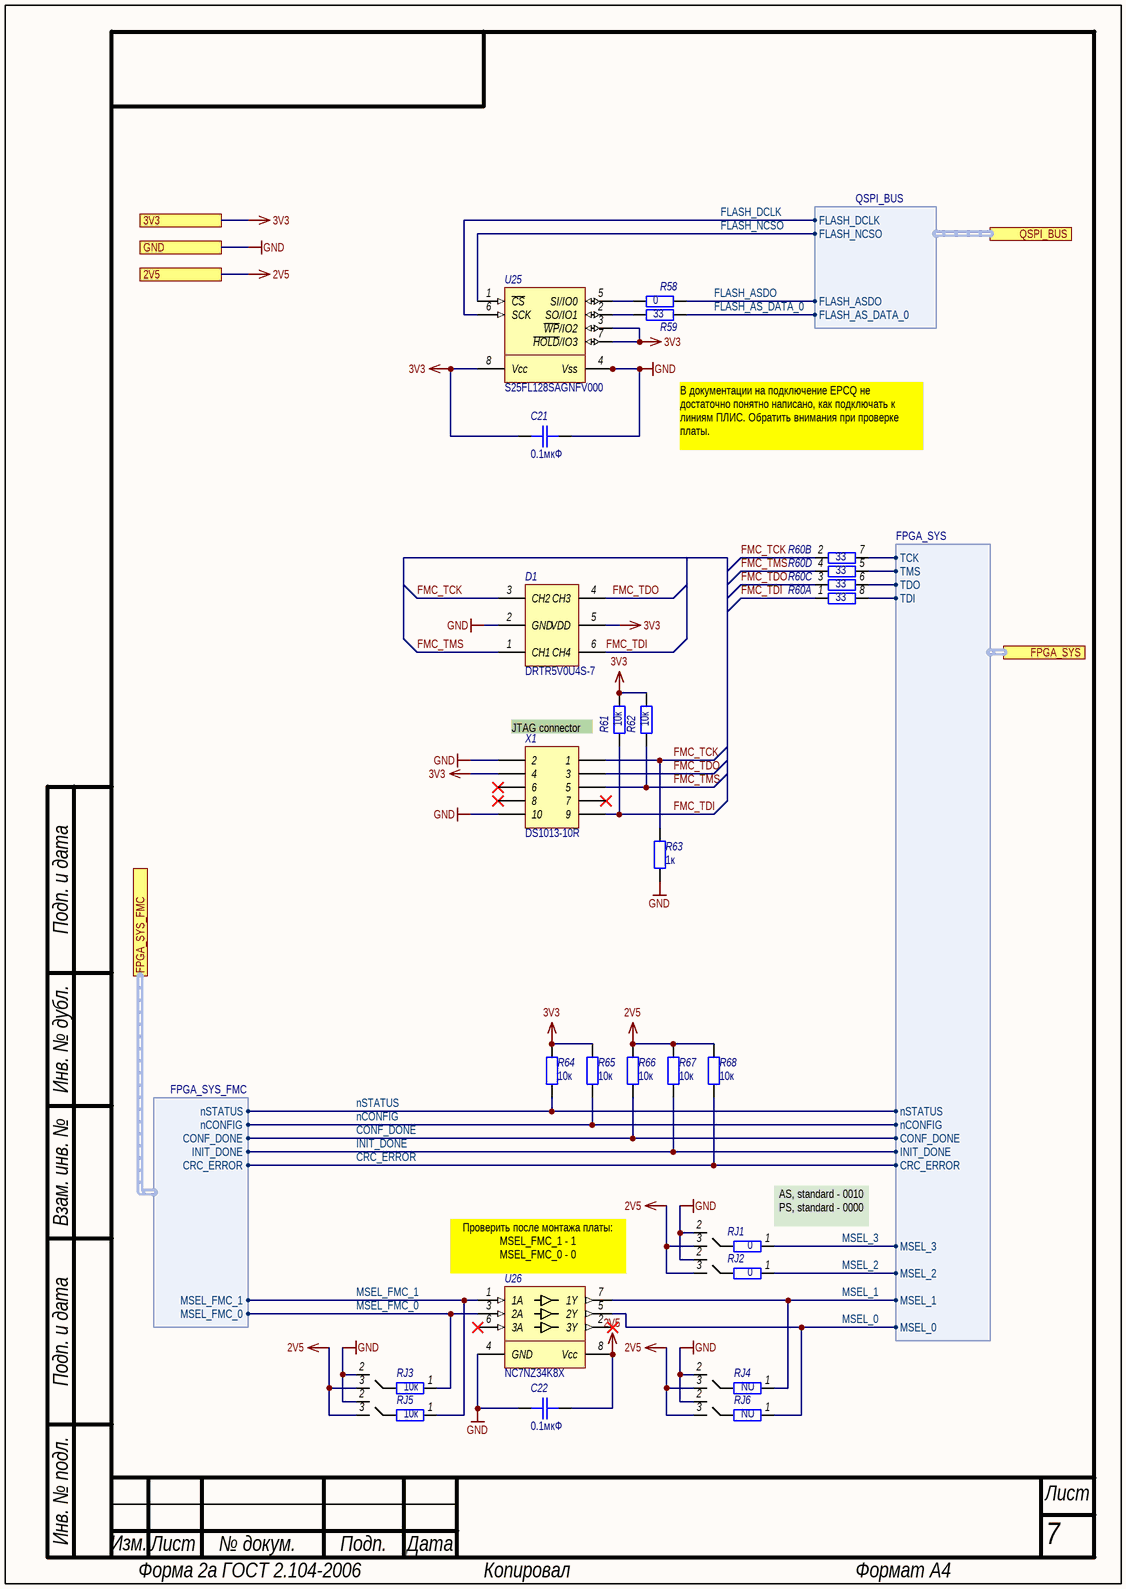
[diagram p10: vme_can_fpga_conf.SchDoc]

### Parts
C21  0.1мкФ  [SMD_C0402]
C22  0.1мкФ  [SMD_C0402]
D1  Наименование: DRTR5V0U4S-7  [SOT-363]  (hidden comment: DRTR5V0U4S)
R58  0  [SMD_0603]
R59  33  [SMD_0603]
R60  value 33  [TC124]  (hidden comment: 4 Chip Resistor Array)  (parts A,B,C,D of 4)
R61  10к  [SMD_0603]
R62  10к  [SMD_0603]
R63  1к  [SMD_0603]
R64  10к  [SMD_0603]
R65  10к  [SMD_0603]
R66  10к  [SMD_0603]
R67  10к  [SMD_0603]
R68  10к  [SMD_0603]
RJ1  0  [SMD_JMP_0603]
RJ2  0  [SMD_JMP_0603]
RJ3  10к  [SMD_JMP_0603]
RJ4  NU  [SMD_JMP_0603]
RJ5  10к  [SMD_JMP_0603]
RJ6  NU  [SMD_JMP_0603]
U25  Наименование: S25FL128SAGNFV000  [WSON-8_6x8]  (hidden comment: S25FL128SAGN)
U26  Наименование: NC7NZ34K8X  [US-8]  (hidden comment: NC7NZ34)
X1  DS1013-10R  [DS1013-10R]

### Ports
2V5, 3V3, FPGA_SYS (harness FPGA_SYS), FPGA_SYS_FMC (harness FPGA_SYS_FMC), GND, QSPI_BUS (harness QSPI_BUS)

### Harnesses
QSPI_BUS: FLASH_ASDO, FLASH_NCSO, FLASH_DCLK, FLASH_AS_DATA_0
FPGA_SYS: TCK, TMS, TDO, TDI, CRC_ERROR, INIT_DONE, nSTATUS, CONF_DONE, nCONFIG, MSEL_0, MSEL_1, MSEL_2, MSEL_3
FPGA_SYS_FMC: INIT_DONE, nSTATUS, CONF_DONE, nCONFIG, MSEL_FMC_0, MSEL_FMC_1, CRC_ERROR

### Nets
2V5: C22.2 R66.2 R67.2 R68.2 RJ1.3 RJ2.3 RJ3.3 RJ4.3 RJ5.3 RJ6.3 U26.8(Vcc) ; port 2V5
3V3: C21.2 D1.5(VDD) R61.2 R62.2 R64.2 R65.2 U25.3(~{WP}/IO2) U25.7(~{HOLD}/IO3) U25.8(Vcc) X1.4 ; port 3V3
GND: C21.1 C22.1 D1.2(GND) R63.1 RJ1.2 RJ2.2 RJ3.2 RJ4.2 RJ5.2 RJ6.2 U25.4(Vss) U25.9(TP) U26.4(GND) X1.2 X1.10 ; port GND
CONF_DONE: R66.1 ; port FPGA_SYS.CONF_DONE, port FPGA_SYS_FMC.CONF_DONE
CRC_ERROR: R68.1 ; port FPGA_SYS.CRC_ERROR, port FPGA_SYS_FMC.CRC_ERROR
FLASH_AS_DATA_0: R59.2 ; port QSPI_BUS.FLASH_AS_DATA_0
FLASH_ASDO: R58.2 ; port QSPI_BUS.FLASH_ASDO
FLASH_DCLK: U25.6(SCK) ; port QSPI_BUS.FLASH_DCLK
FLASH_NCSO: U25.1(~{CS}) ; port QSPI_BUS.FLASH_NCSO
FMC_TCK: D1.3(СH2) R60.2 R63.2 X1.1
FMC_TDI: D1.6(СH4) R60.1 R61.1 X1.9
FMC_TDO: D1.4(СH3) R60.3 X1.3
FMC_TMS: D1.1(СH1) R60.4 R62.1 X1.5
INIT_DONE: R67.1 ; port FPGA_SYS.INIT_DONE, port FPGA_SYS_FMC.INIT_DONE
MSEL_0: RJ6.1 U26.5(2Y) ; port FPGA_SYS.MSEL_0
MSEL_1: RJ4.1 U26.7(1Y) ; port FPGA_SYS.MSEL_1
MSEL_2: RJ2.1 ; port FPGA_SYS.MSEL_2
MSEL_3: RJ1.1 ; port FPGA_SYS.MSEL_3
MSEL_FMC_0: RJ3.1 U26.3(2A) ; port FPGA_SYS_FMC.MSEL_FMC_0
MSEL_FMC_1: RJ5.1 U26.1(1A) ; port FPGA_SYS_FMC.MSEL_FMC_1
nCONFIG: R65.1 ; port FPGA_SYS.nCONFIG, port FPGA_SYS_FMC.nCONFIG
nSTATUS: R64.1 ; port FPGA_SYS.nSTATUS, port FPGA_SYS_FMC.nSTATUS
NetR58_1: R58.1 U25.5(SI/IO0)
NetR59_1: R59.1 U25.2(SO/IO1)
NetR60_5: R60.5 ; port FPGA_SYS.TMS
NetR60_6: R60.6 ; port FPGA_SYS.TDO
NetR60_7: R60.7 ; port FPGA_SYS.TCK
NetR60_8: R60.8 ; port FPGA_SYS.TDI

Not connected (* = marked no-connect by the designer): U26 2(3Y)* 6(3A)*; X1 6* 7* 8*

### Notes on the sheet
- В документации на подключение EPCQ не достаточно понятно написано, как подключать к линиям ПЛИС. Обратить внимания при проверке платы.
- JTAG connector
- (near U26) Проверить после монтажа платы:
  MSEL_FMC_1 - 1
  MSEL_FMC_0 - 0
- (near RJ1) AS, standard - 0010
  PS, standard - 0000
- Подп. и дата
- Инв. № дубл.
- Взам. инв. №
- Инв. № подл.
- Изм.
- Лист
- № докум.
- Подп.
- Дата
- Форма 2а ГОСТ 2.104-2006
- Копировал
- Формат А4

### Library data of the parts
C21 C22 = Capacitor: as C42 on sheet vme_can_fpga_pwr; Value: 0.1мкФ
D1 = DRTR5V0U4S: 4 CHANNEL LOW CAPACITANCE TVS DIODE ARRAY; Потребление, Вт: 0.0; Назначение: 4 CHANNEL LOW CAPACITANCE TVS DIODE ARRAY; ComponentLink1Description: DataSheet; ComponentLink1URL: DRTR5V0U4S; Supplier 1: Digi-Key; Supplier Part Number 1: DRTR5V0U4S-7DICT-ND
R58 R59 = Resistor: PE1206DRM470R01L; Наименование: Резистор; Назначение: SMD-резистор; Потребление, Вт: 0,001
  R58: Value: 0
  R59: Value: 33
R60 = Resistor-4: Потребление, Вт: 0.0; Наименование: TC124-FR-0733RL; Назначение: 4 Chip Resistor Array; Описание: TC124-FR-0733RL
R61-R68 = Resistor: Наименование: Резистор; Назначение: SMD-резистор; Потребление, Вт: 0,001
  R61 R62 R64-R68: Value: 10к
  R63: Value: 1к
RJ1-RJ6 = Resistor_Jamper: Resistor-Jumper; Назначение: Резистор для выбора режима; Наименование: Резистор; Потребление, Вт: 0,0
  RJ1 RJ2: Value: 0
  RJ3 RJ5: Value: 10к
  RJ4 RJ6: Value: NU
U25 = S25FL128SAGN: Programmable NOR flash memory; Потребление, Вт: 0.1; Назначение: Programmable NOR flash memory
U26 = NC7NZ34: TinyLogic UHS Triple Buffer; Потребление, Вт: 0.01; Назначение: TinyLogic UHS Triple Buffer; ComponentLink1Description: DataSheet; ComponentLink1URL: https://www.onsemi.com/pdf/datasheet/nc7nz34-d.pdf; Supplier 1: Digi-Key; Supplier Part Number 1: NC7NZ34K8XCT-ND
X1 = Header 2X10: Header, 10-Pin, Dual row; Потребление, Вт: 0,0; Назначение: Header, 10-Pin, Dual row; Наименование: DS1013-10R

## Nets that join several sheets
2V5: vme_can_fpga_pwr (40 pins), vme_can_fpga_conf (11 pins)
3V3: can_0 (10 pins), can_1 (10 pins), can_2 (10 pins), can_3 (10 pins), vme_can_vme_2 (18 pins), vme_can_vme_1 (17 pins), vme_can_fpga_pwr (38 pins), vme_can_fpga_conf (10 pins)
5V: can_0 (26 pins), can_1 (26 pins), can_2 (26 pins), can_3 (26 pins)
5V_VME: vme_can_vme_2 (9 pins), vme_can_vme_1 (25 pins)
CAN_5V: can_0 (5 pins), can_1 (5 pins), can_2 (5 pins), can_3 (5 pins)
CAN_GND: can_0 (8 pins), can_1 (8 pins), can_2 (8 pins), can_3 (8 pins)
CASE: can_0 (P1_can_0.M1 P1_can_0.M2), can_1 (P1_can_1.M1 P1_can_1.M2), can_2 (P1_can_2.M1 P1_can_2.M2), can_3 (P1_can_3.M1 P1_can_3.M2)
GND: can_0 (50 pins), can_1 (50 pins), can_2 (50 pins), can_3 (50 pins), vme_can_vme_2 (27 pins), vme_can_vme_1 (45 pins), vme_can_fpga_bridge (U24.K21 U24.L3 U24.N21 U24.N22), vme_can_fpga_pwr (98 pins), vme_can_fpga_conf (15 pins)